# EAGLE design rfidboard (EAGLE 9.6.2)
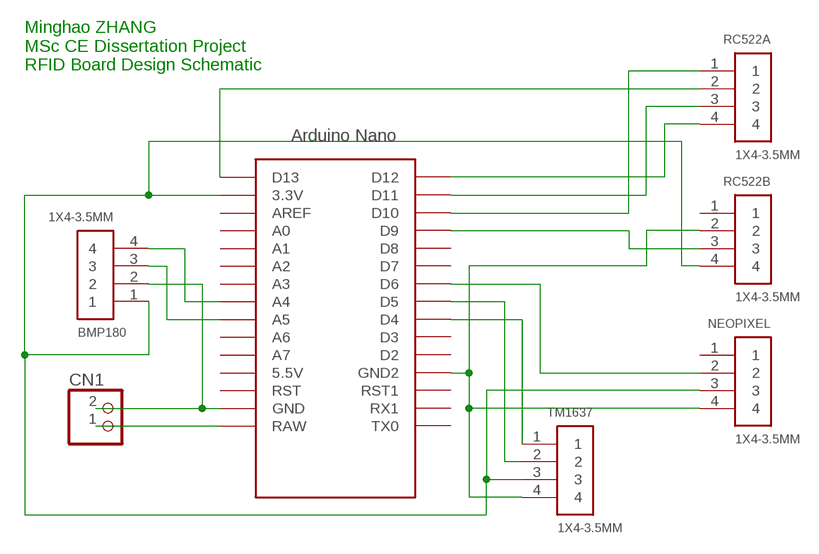
[diagram p0: schematic, sheet 1]

## Parts
BMP180  1X4-3.5MM  [1X04-3.5MM]
CN1  JST_2PIN-SMT  [JST-PH-2-SMT]
NEOPIXEL  1X4-3.5MM  [1X04-3.5MM]
RC522A  1X4-3.5MM  [1X04-3.5MM]
RC522B  1X4-3.5MM  [1X04-3.5MM]
TM1637  1X4-3.5MM  [1X04-3.5MM]
U$1  NANO  [NANO]

## Nets
N$1: CN1.1 U$1.RAW
N$2: BMP180.2 CN1.2 U$1.GND
N$3: TM1637.1 U$1.D4
N$4: TM1637.2 U$1.D5
N$5: BMP180.1 NEOPIXEL.3 RC522B.4 TM1637.3 U$1.3.3V
N$6: NEOPIXEL.4 RC522B.2 TM1637.4 U$1.GND1(GND2)
N$7: NEOPIXEL.2 U$1.D6
N$8: RC522A.1 U$1.D10
N$9: BMP180.4 U$1.A4
N$10: BMP180.3 U$1.A5
N$11: RC522A.2 U$1.D13
N$12: RC522A.3 U$1.D11
N$13: RC522A.4 U$1.D12
N$14: RC522B.3 U$1.D9
Unconnected: NEOPIXEL.1 RC522B.1 U$1.5V(5.5V) U$1.A0 U$1.A1 U$1.A2 U$1.A3 U$1.A6 U$1.A7 U$1.AREF U$1.D2 U$1.D3 U$1.D7 U$1.D8 U$1.ICSP1 U$1.ICSP2 U$1.ICSP3 U$1.ICSP4 U$1.ICSP5 U$1.ICSP6 U$1.RST U$1.RST1 U$1.RX1 U$1.TX0

## Notes on the sheet
- Minghao ZHANG
  MSc CE Dissertation Project
  RFID Board Design Schematic

## Library data of the parts
BMP180 NEOPIXEL RC522A RC522B TM1637 = adafruit:1X4: 4-pin connector
CN1 = adafruit:JST_2PIN: JST 2-Pin Connectors of various flavors SMT-RA (S2B-PH-SM4) 4UConnector #17311 SMT (B2B-PH-SM4) THM-RA (S2B-PH) THM (B2B-PH)
U$1 = Arduino-clone:NANO: Arduino Nano

## Board
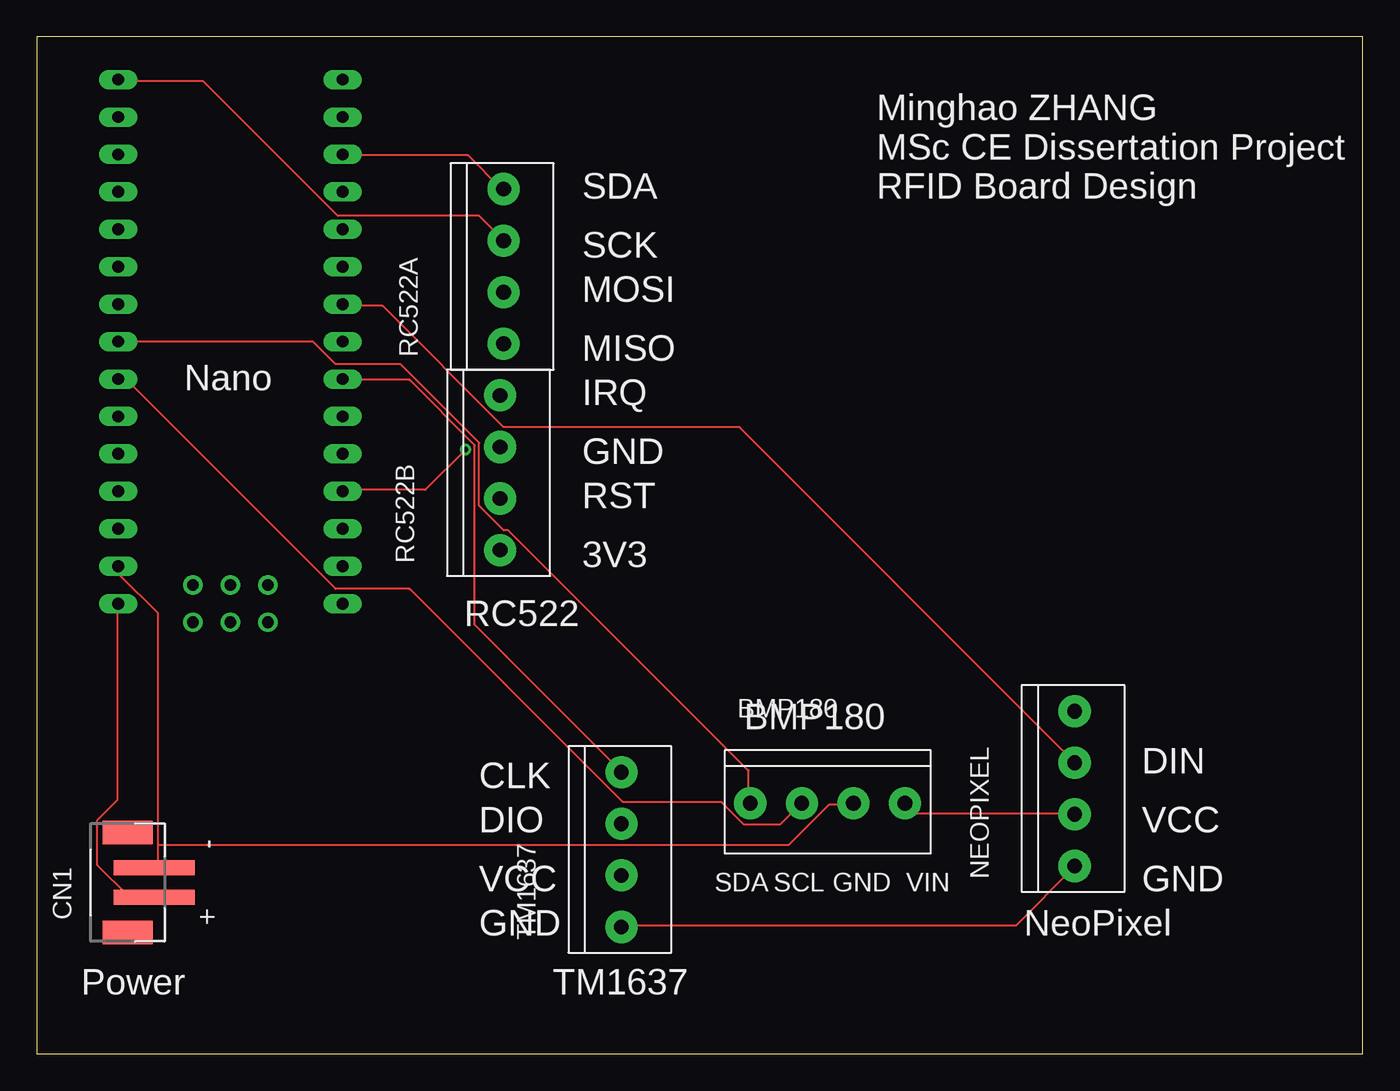
[diagram p1: board, top side]
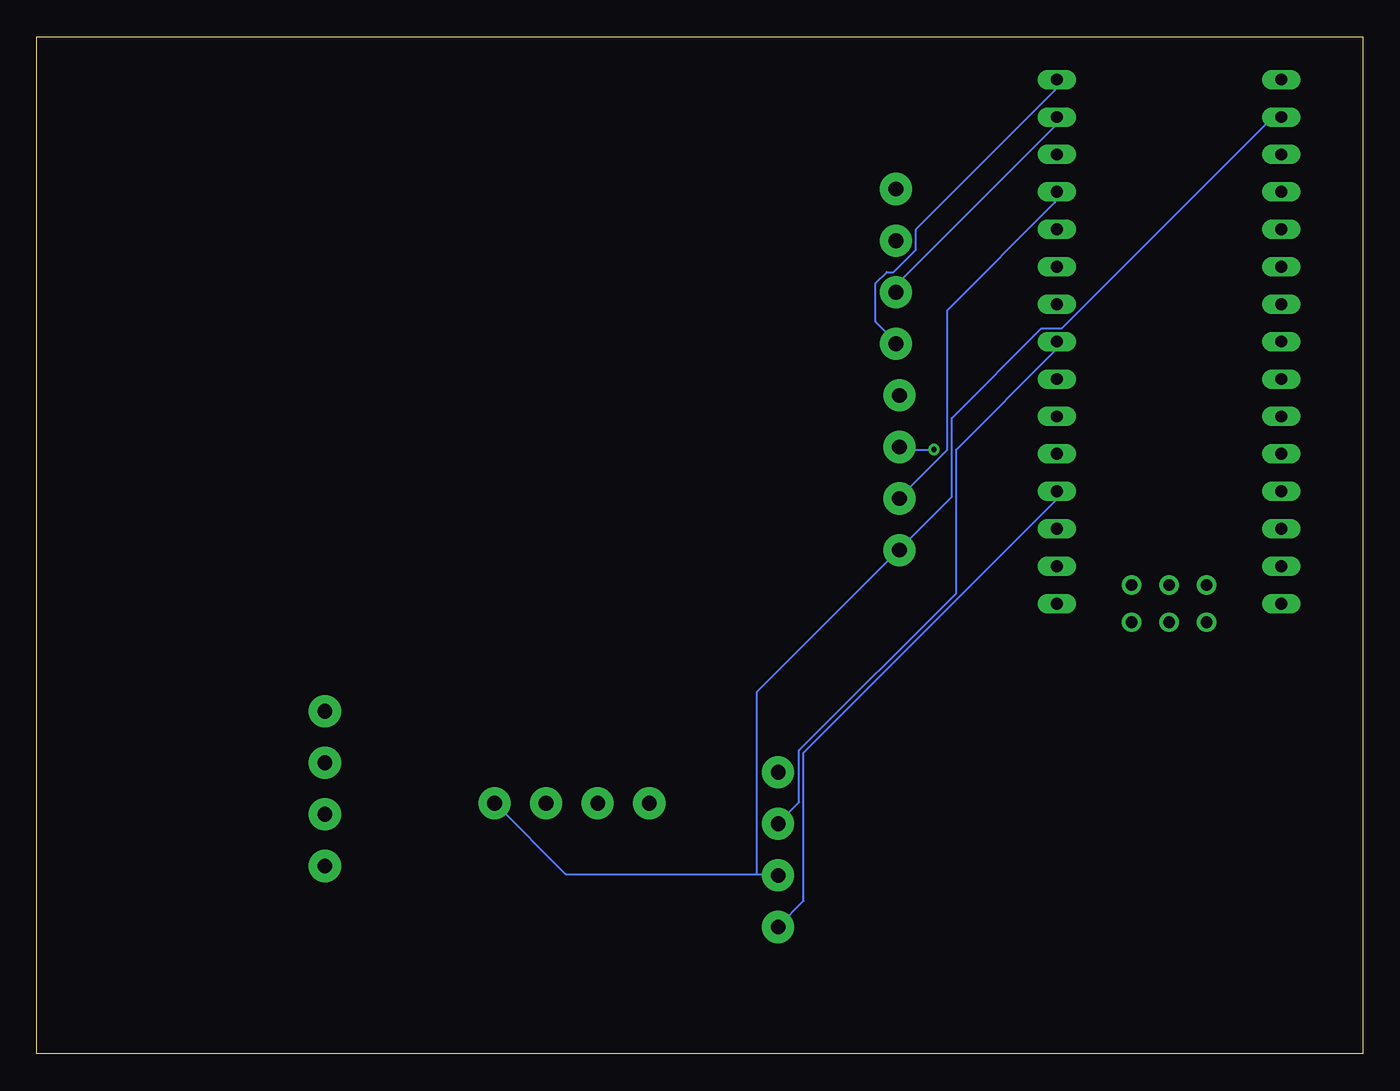
[diagram p2: board, bottom side, seen from below]

Size 90 x 69 mm. Coordinates in mm from the lower left corner, seen from the top.
Outline: 0,0 90,0 90,69 0,69 0,0
Copper layers (1*16): Top 0.035mm / dielectric 1.5mm / Bottom 0.035mm
Design rules "default": minimum track width 6mil, minimum drill 0.35mm, track to track 6mil, track to pad 6mil, pad to pad 6mil, via to via 6mil, smd to smd 6mil, copper to edge 40mil, drill to drill 6mil, minimum pad ring 10mil, minimum via ring 8mil, stop-mask expansion 4mil, vias tented up to drill 0mil, thermal gap 10mil

### Footprints (pad centres in the part's own frame; a part is rotated, then mirrored left to right if it is on the bottom)
1X04-3.5MM = drill 1 pad 2.184: 1 -5.25,0; 2 -1.75,0; 3 1.75,0; 4 5.25,0
JST-PH-2-SMT = smd 1 x 5.5: 1 -1,-1.8; 2 1,-1.8 | smd 1.6 x 3.4: NC1 -3.4,0; NC2 3.4,0
NANO = drill 0.8 long: 3.3V -10.16,24.13; 5V -10.16,-1.27; A0 -10.16,19.05; A1 -10.16,16.51; A2 -10.16,13.97; A3 -10.16,11.43; A4 -10.16,8.89; A5 -10.16,6.35; A6 -10.16,3.81; A7 -10.16,1.27; AREF -10.16,21.59; D2 5.08,1.27; D3 5.08,3.81; D4 5.08,6.35; D5 5.08,8.89; D6 5.08,11.43; D7 5.08,13.97; D8 5.08,16.51; D9 5.08,19.05; D10 5.08,21.59; D11 5.08,24.13; D12 5.08,26.67; D13 -10.16,26.67; GND -10.16,-6.35; GND1 5.08,-1.27; RAW -10.16,-8.89; RST -10.16,-3.81; RST1 5.08,-3.81; RX1 5.08,-6.35; TX0 5.08,-8.89 | drill 0.8: ICSP1 -5.08,-10.16; ICSP2 -5.08,-7.62; ICSP3 -2.54,-10.16; ICSP4 -2.54,-7.62; ICSP5 0,-10.16; ICSP6 0,-7.62

### Placement (x,y rotation side)
BMP180  53.68,16.99 180 top
CN1  6.17,11.62 90 top
NEOPIXEL  70.44,17.99 270 top
RC522A  31.68,53.42 270 top
RC522B  31.44,39.42 270 top
TM1637  39.68,13.85 270 top
U$1  15.68,39.43 0 top

### Tracks (layer width: path | path; a pad name or v marks a point on that pad's centre or on a via)
N$1
  Top 0.152: U$1.RAW 5.49,30.48 5.49,17.22 4.12,15.85 4.12,12.8 6.25,10.67 7.92,10.67 CN1.1
N$2
  Top 0.152: 8.23,14.17 8.23,12.8 8.08,12.65 CN1.2 | 8.23,14.17 8.23,29.87 5.64,32.46 5.64,33.07 U$1.GND | 8.23,14.17 51.05,14.17 53.8,16.92 55.32,16.92 BMP180.2
N$3
  Top 0.152: U$1.D4 20.88,45.72 25.3,45.72 29.72,41.3 29.72,29.11 39.62,19.2 TM1637.1
N$4
  Bottom 0.152: U$1.D5 20.88,48.31 20.88,47.7 27.58,41 27.58,31.24 38.25,20.57 38.25,17.07 39.62,15.7 TM1637.2
N$5
  Top 0.152: NEOPIXEL.3 70.41,16.31 59.59,16.31 58.98,16.92 BMP180.1
  Bottom 0.152: 41.15,12.19 54.1,12.19 58.83,16.92 BMP180.1 | 41.15,12.19 39.78,12.19 TM1637.3 | U$1.3.3V 5.64,63.55 6.1,63.55 20.42,49.23 21.79,49.23 27.89,43.13 27.89,37.8 31.39,34.29 RC522B.4 31.55,34.14 41.15,24.54 41.15,12.19
N$6  (via drill 0.35)
  Top 0.152: v29.11,41 26.36,38.25 20.88,38.25 U$1.GND1 | TM1637.4 39.78,8.69 66.45,8.69 70.41,12.65 NEOPIXEL.4
  Bottom 0.152: v29.11,41 31.24,41 31.39,41.15 RC522B.2 | U$1.GND1 20.88,38.1 20.88,37.49 37.95,20.42 37.95,10.36 39.62,8.69 TM1637.4
N$7
  Top 0.152: U$1.D6 20.88,50.75 23.47,50.75 31.7,42.52 47.7,42.52 70.41,19.81 NEOPIXEL.2
N$8
  Top 0.152: U$1.D10 20.88,60.96 29.26,60.96 31.55,58.67 RC522A.1
N$9
  Top 0.152: U$1.A4 5.64,48.31 18.75,48.31 20.27,46.79 24.69,46.79 30.02,41.45 30.02,37.19 31.7,35.51 32,35.51 48.31,19.2 48.31,17.07 BMP180.4
N$10
  Top 0.152: U$1.A5 5.64,45.72 6.1,45.72 20.27,31.55 25.3,31.55 39.78,17.07 46.48,17.07 48.01,15.54 50.44,15.54 51.82,16.92 BMP180.3
N$11
  Top 0.152: U$1.D13 5.64,65.99 11.28,65.99 20.42,56.84 30.02,56.84 31.55,55.32 RC522A.2
N$12
  Bottom 0.152: U$1.D11 20.88,63.55 20.88,62.94 31.55,52.27 31.55,51.82 RC522A.3
N$13
  Bottom 0.152: U$1.D12 20.88,65.99 20.88,65.38 30.33,55.93 30.33,54.56 31.85,53.03 32.31,53.03 33.07,52.27 33.07,49.68 31.7,48.31 RC522A.4
N$14
  Bottom 0.152: U$1.D9 20.88,58.37 20.88,57.76 28.19,50.44 28.19,41 31.39,37.8 RC522B.3

### Text on the board
tPlace: SDA | Minghao ZHANG / MSc CE Dissertation Project / RFID Board Design | SCK | MOSI | MISO | Nano | IRQ | GND | RST | 3V3 | RC522 | BMP180 | DIN | CLK | DIO | VCC | VCC | SDA | SCL | GND | VIN | GND | GND | NeoPixel | Power | TM1637